# EAGLE design v1 (EAGLE 5.11)
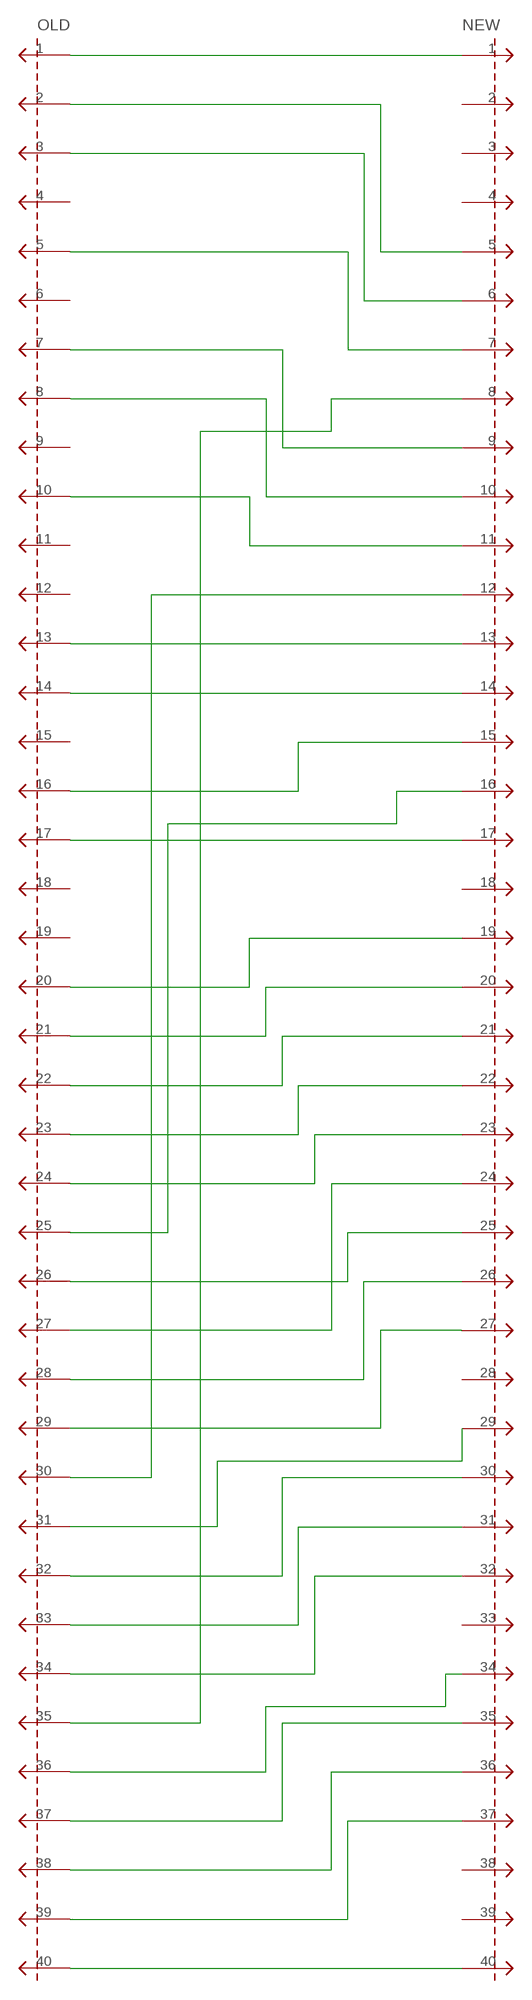
[diagram p0: schematic, sheet 1]

## Parts
NEW  NEW_LCDNEW_LCD  [NEW_LCD]
OLD  NEW_LCDOLD_LCD  [OLD_LCD]

## Nets
N$1: NEW.1 OLD.1
N$2: NEW.21 OLD.22
N$3: NEW.20 OLD.21
N$4: NEW.19 OLD.20
N$5: NEW.17 OLD.17
N$6: NEW.22 OLD.23
N$7: NEW.23 OLD.24
N$8: NEW.24 OLD.27
N$9: NEW.16 OLD.25
N$10: NEW.15 OLD.16
N$11: NEW.14 OLD.14
N$12: NEW.13 OLD.13
N$13: NEW.25 OLD.26
N$14: NEW.26 OLD.28
N$15: NEW.27 OLD.29
N$16: NEW.30 OLD.32
N$17: NEW.29 OLD.31
N$18: NEW.11 OLD.10
N$19: NEW.10 OLD.8
N$20: NEW.9 OLD.7
N$21: NEW.31 OLD.33
N$22: NEW.32 OLD.34
N$23: NEW.12 OLD.30
N$24: NEW.35 OLD.37
N$25: NEW.34 OLD.36
N$26: NEW.7 OLD.5
N$27: NEW.6 OLD.3
N$28: NEW.5 OLD.2
N$29: NEW.36 OLD.38
N$30: NEW.37 OLD.39
N$31: NEW.8 OLD.35
N$32: NEW.40 OLD.40
Unconnected: NEW.2 NEW.3 NEW.4 NEW.18 NEW.28 NEW.33 NEW.38 NEW.39 OLD.4 OLD.6 OLD.9 OLD.11 OLD.12 OLD.15 OLD.18 OLD.19

## Library data of the parts
NEW OLD = osat:NEW_LCD

## Board
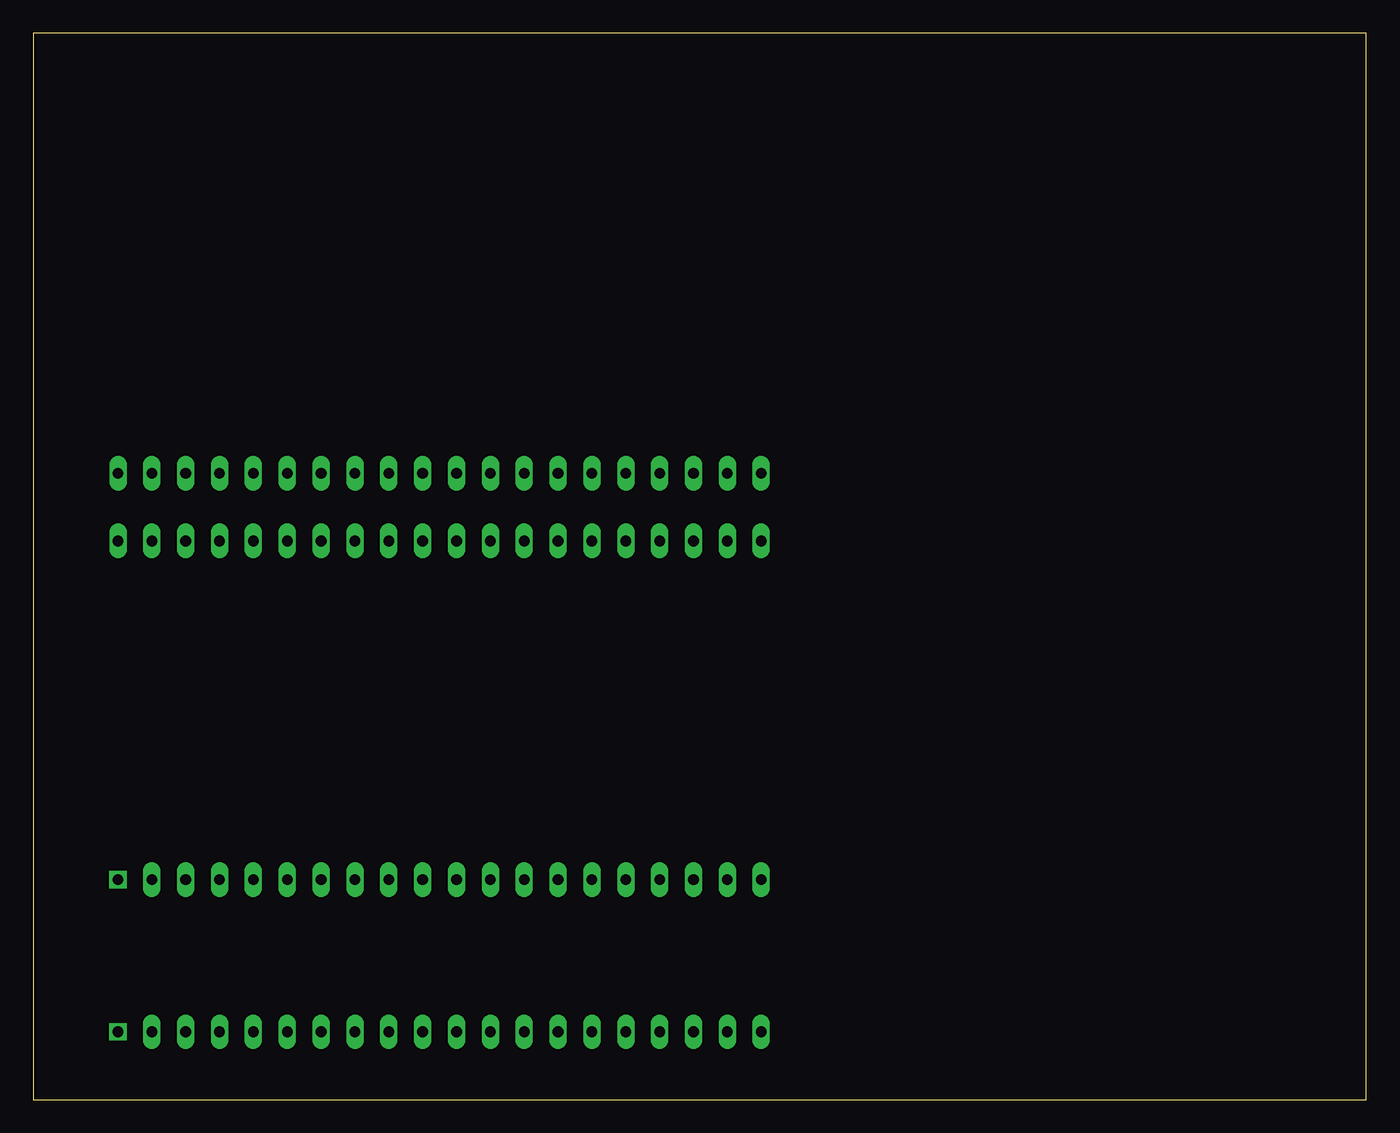
[diagram p1: board, top side]
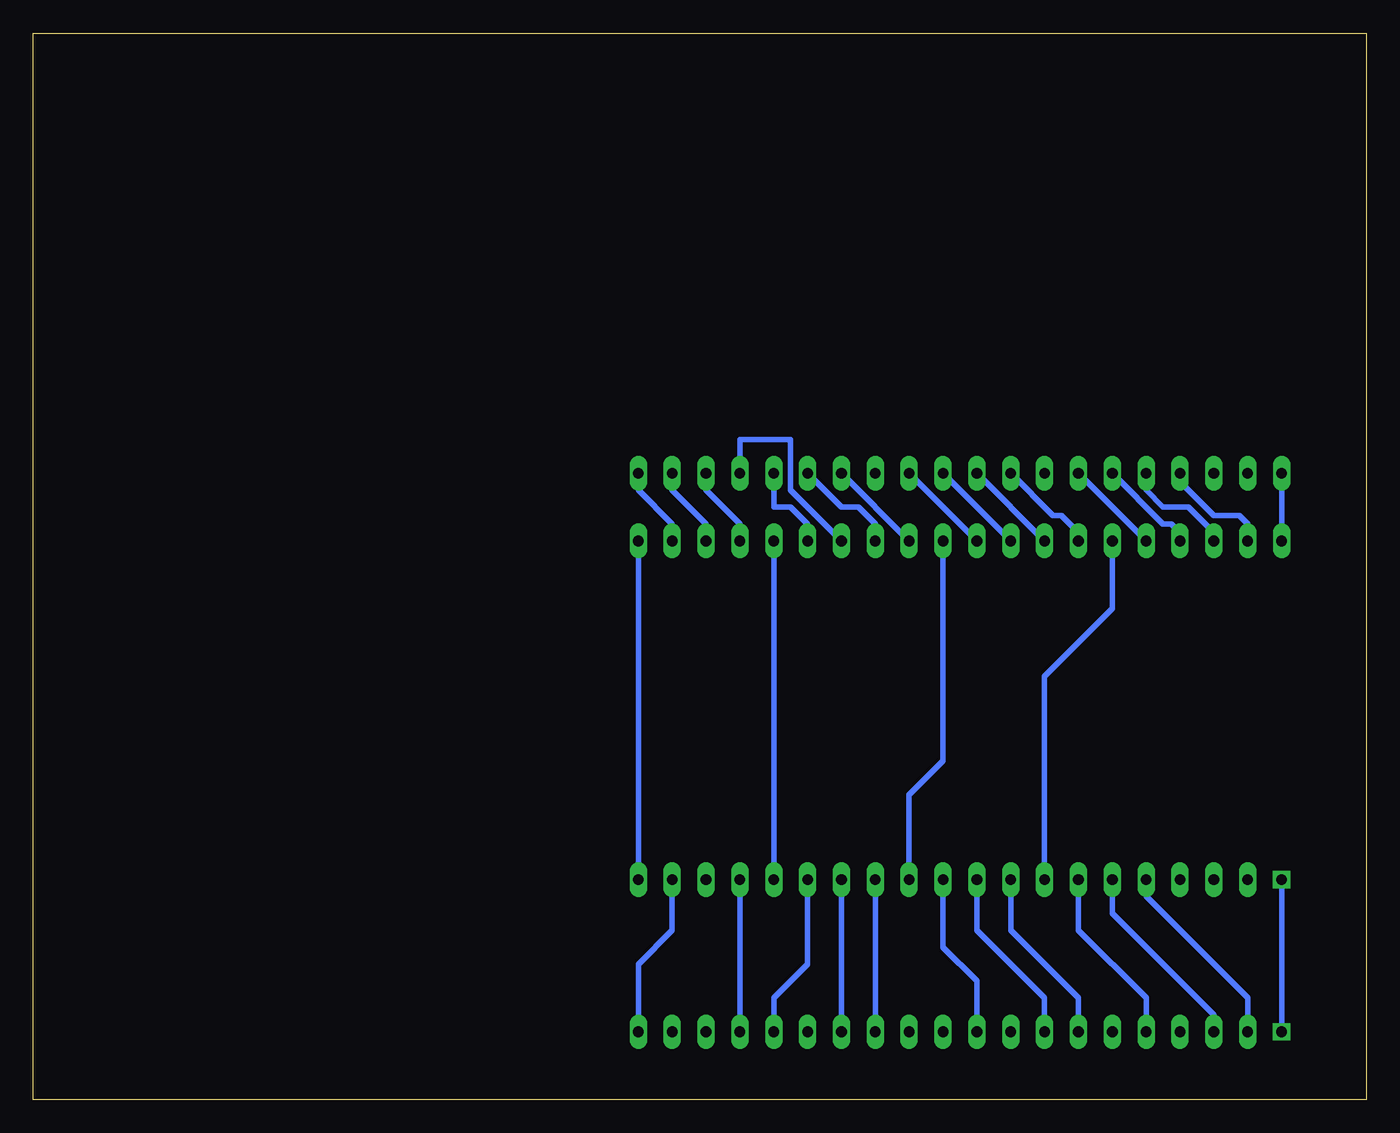
[diagram p2: board, bottom side, seen from below]

Size 100 x 80 mm. Coordinates in mm from the lower left corner, seen from the top.
Outline: 0,0 100,0 100,80 0,80 0,0
Copper layers (1*16): Top 0.035mm / dielectric 1.5mm / Bottom 0.035mm
Design rules "default": minimum track width 10mil, minimum drill 24mil, track to track 8mil, track to pad 8mil, pad to pad 8mil, via to via 8mil, smd to smd 8mil, copper to edge 40mil, drill to drill 8mil, minimum pad ring 10mil, minimum via ring 8mil, stop-mask expansion 4mil, vias tented up to drill 0mil, thermal gap 10mil

### Footprints (pad centres in the part's own frame; a part is rotated, then mirrored left to right if it is on the bottom)
NEW_LCD = drill 0.8 square: 1 0,-30.48 | drill 0.8 long: 2 2.54,-30.48; 3 5.08,-30.48; 4 7.62,-30.48; 5 10.16,-30.48; 6 12.7,-30.48; 7 15.24,-30.48; 8 17.78,-30.48; 9 20.32,-30.48; 10 22.86,-30.48; 11 25.4,-30.48; 12 27.94,-30.48; 13 30.48,-30.48; 14 33.02,-30.48; 15 35.56,-30.48; 16 38.1,-30.48; 17 40.64,-30.48; 18 43.18,-30.48; 19 45.72,-30.48; 20 48.26,-30.48; 21 48.26,0; 22 45.72,0; 23 43.18,0; 24 40.64,0; 25 38.1,0; 26 35.56,0; 27 33.02,0; 28 30.48,0; 29 27.94,0; 30 25.4,0; 31 22.86,0; 32 20.32,0; 33 17.78,0; 34 15.24,0; 35 12.7,0; 36 10.16,0; 37 7.62,0; 38 5.08,0; 39 2.54,0; 40 0,0
OLD_LCD = drill 0.8 square: 1 0,-36.83 | drill 0.8 long: 2 2.54,-36.83; 3 5.08,-36.83; 4 7.62,-36.83; 5 10.16,-36.83; 6 12.7,-36.83; 7 15.24,-36.83; 8 17.78,-36.83; 9 20.32,-36.83; 10 22.86,-36.83; 11 25.4,-36.83; 12 27.94,-36.83; 13 30.48,-36.83; 14 33.02,-36.83; 15 35.56,-36.83; 16 38.1,-36.83; 17 40.64,-36.83; 18 43.18,-36.83; 19 45.72,-36.83; 20 48.26,-36.83; 21 48.26,0; 22 45.72,0; 23 43.18,0; 24 40.64,0; 25 38.1,0; 26 35.56,0; 27 33.02,0; 28 30.48,0; 29 27.94,0; 30 25.4,0; 31 22.86,0; 32 20.32,0; 33 17.78,0; 34 15.24,0; 35 12.7,0; 36 10.16,0; 37 7.62,0; 38 5.08,0; 39 2.54,0; 40 0,0

### Placement (x,y rotation side)
NEW  6.35,46.99 0 top
OLD  6.35,41.91 0 top

### Tracks (layer width: path | path; a pad name or v marks a point on that pad's centre or on a via)
N$1
  Bottom 0.406: OLD.1 NEW.1
N$2
  Bottom 0.406: OLD.22 52.07,43.18 54.61,45.72 NEW.21
N$3
  Bottom 0.406: NEW.20 OLD.21
N$4
  Bottom 0.406: NEW.19 52.07,12.7 54.61,10.16 OLD.20
N$5
  Bottom 0.406: OLD.17 NEW.17
N$6
  Bottom 0.406: NEW.22 52.07,45.72 49.53,43.18 OLD.23
N$7
  Bottom 0.406: OLD.24 46.99,43.18 49.53,45.72 NEW.23
N$8
  Bottom 0.406: OLD.27 43.18,45.72 43.18,49.53 46.99,49.53 NEW.24
N$9
  Bottom 0.406: NEW.16 OLD.25
N$10
  Bottom 0.406: NEW.15 41.91,10.16 44.45,7.62 OLD.16
N$11
  Bottom 0.406: OLD.14 NEW.14
N$12
  Bottom 0.406: NEW.13 OLD.13
N$13
  Bottom 0.406: NEW.25 44.45,44.45 43.18,44.45 41.91,43.18 OLD.26
N$14
  Bottom 0.406: NEW.26 39.37,44.45 38.1,44.45 36.83,43.18 OLD.28
N$15
  Bottom 0.406: OLD.29 NEW.27
N$16
  Bottom 0.406: OLD.32 NEW.30
N$17
  Bottom 0.406: OLD.31 NEW.29
N$18
  Bottom 0.406: OLD.10 29.21,8.89 31.75,11.43 NEW.11
N$19
  Bottom 0.406: NEW.10 29.21,12.7 24.13,7.62 OLD.8
N$20
  Bottom 0.406: OLD.7 21.59,7.62 26.67,12.7 NEW.9
N$21
  Bottom 0.406: OLD.33 NEW.31
N$22
  Bottom 0.406: OLD.34 21.59,42.55 22.86,43.81 23.5,43.81 NEW.32
N$23
  Bottom 0.406: OLD.30 31.75,25.4 34.29,22.86 NEW.12
N$24
  Bottom 0.406: OLD.37 13.97,42.55 14.61,43.18 15.24,43.18 NEW.35
N$25
  Bottom 0.406: OLD.36 NEW.34
N$26
  Bottom 0.406: OLD.5 16.51,7.62 21.59,12.7 NEW.7
N$27
  Bottom 0.406: NEW.6 19.05,13.97 11.43,6.35 OLD.3
N$28
  Bottom 0.406: OLD.2 8.89,7.62 16.51,15.24 NEW.5
N$29
  Bottom 0.406: OLD.38 11.43,42.55 13.34,44.45 15.24,44.45 16.51,45.72 NEW.36
N$30
  Bottom 0.406: OLD.39 8.89,43.18 9.53,43.81 11.43,43.81 13.97,46.35 NEW.37
N$31
  Bottom 0.406: NEW.8 24.13,31.75 19.05,36.83 OLD.35
N$32
  Bottom 0.406: OLD.40 NEW.40